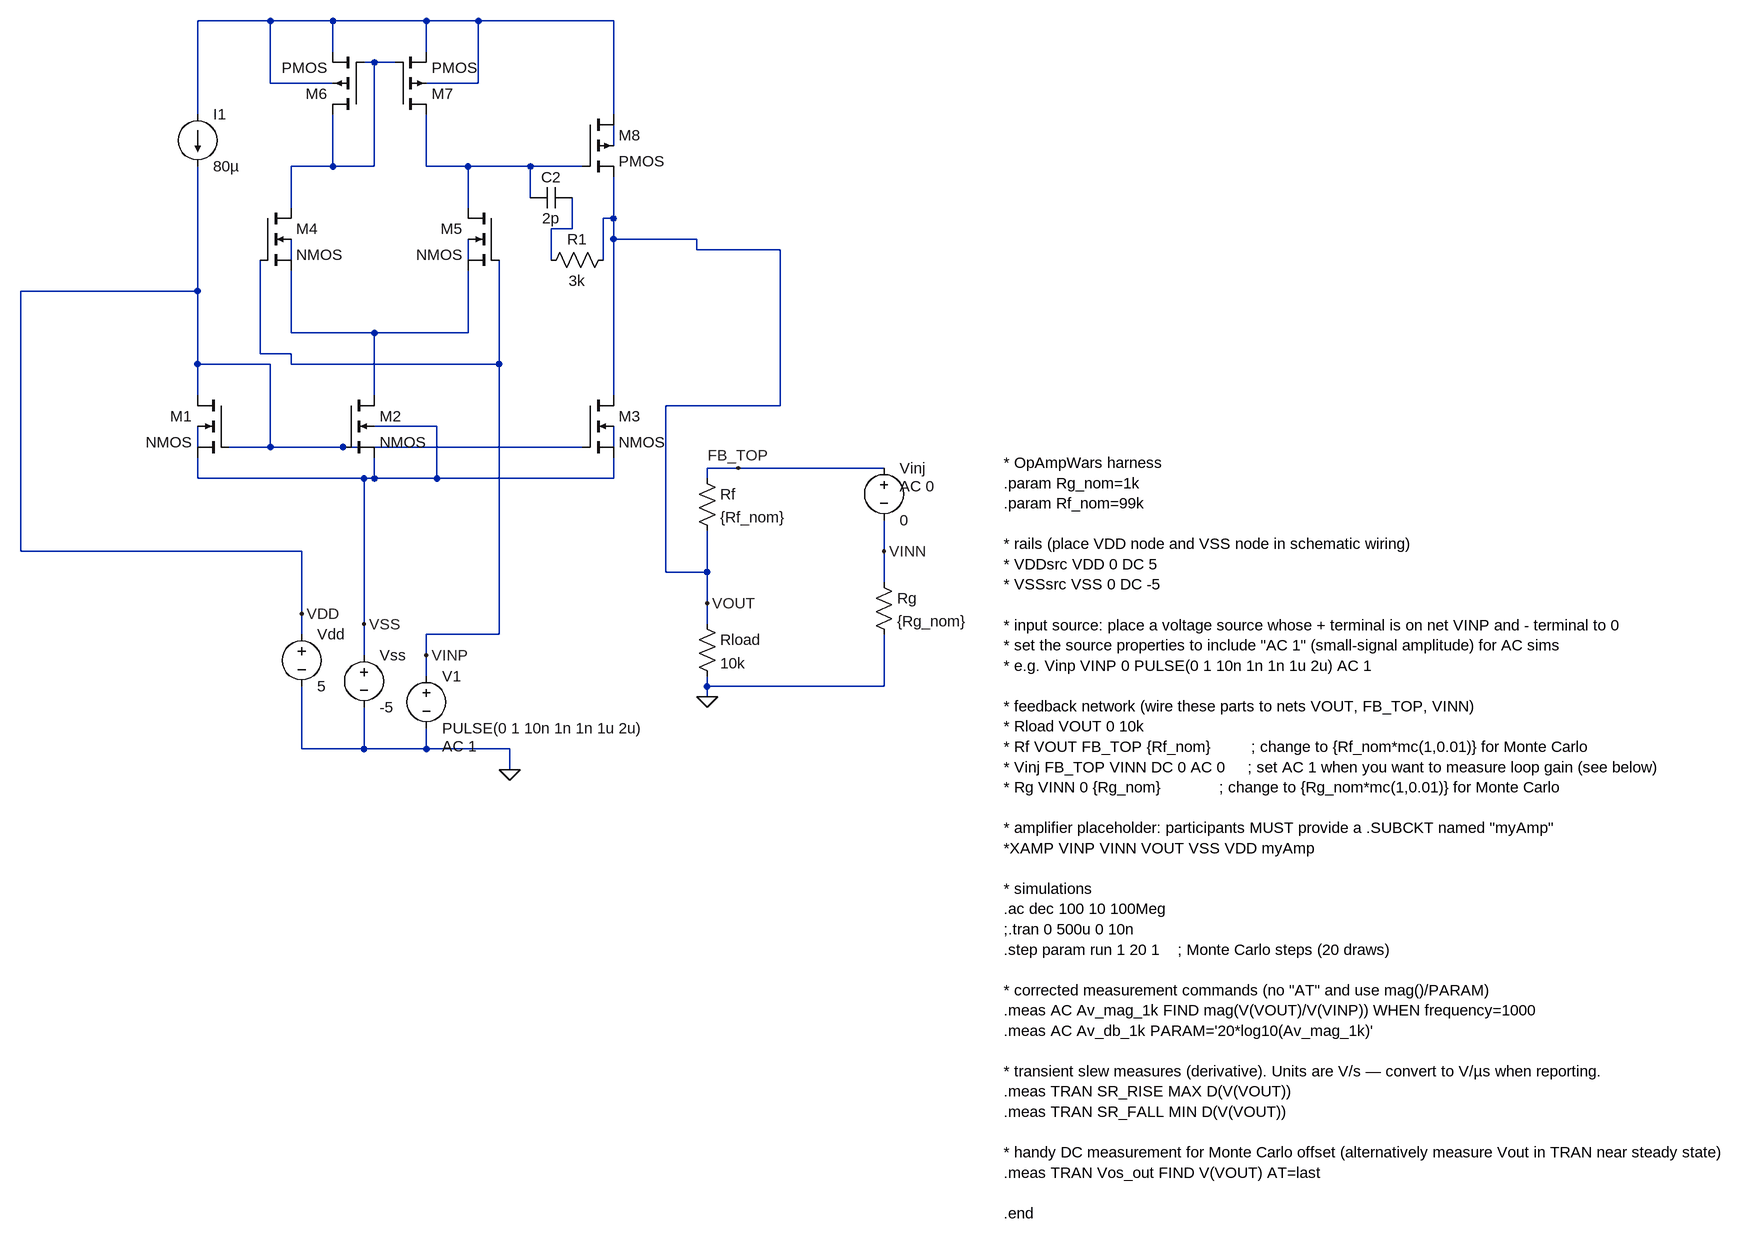
[diagram p0: schematic test.asc]
test.asc, the LTspice schematic file:
Version 4
SHEET 1 3004 2024
WIRE -144 -928 -256 -928
WIRE -48 -928 -144 -928
WIRE 96 -928 -48 -928
WIRE 176 -928 96 -928
WIRE 384 -928 176 -928
WIRE -48 -880 -48 -928
WIRE 96 -880 96 -928
WIRE 16 -864 0 -864
WIRE 48 -864 16 -864
WIRE -144 -832 -144 -928
WIRE -48 -832 -144 -832
WIRE 176 -832 176 -928
WIRE 176 -832 96 -832
WIRE -256 -784 -256 -928
WIRE 384 -784 384 -928
WIRE 384 -736 384 -768
WIRE -48 -704 -48 -784
WIRE -48 -704 -112 -704
WIRE 16 -704 16 -864
WIRE 16 -704 -48 -704
WIRE 96 -704 96 -784
WIRE 160 -704 96 -704
WIRE 256 -704 160 -704
WIRE 336 -704 256 -704
WIRE 256 -656 256 -704
WIRE -112 -640 -112 -704
WIRE 160 -640 160 -704
WIRE 384 -624 384 -688
WIRE 384 -624 368 -624
WIRE 320 -608 320 -656
WIRE 320 -608 288 -608
WIRE 384 -592 384 -624
WIRE 512 -592 384 -592
WIRE 512 -576 512 -592
WIRE 640 -576 512 -576
WIRE -112 -560 -112 -592
WIRE 160 -560 160 -592
WIRE 288 -560 288 -608
WIRE 368 -560 368 -624
WIRE -256 -512 -256 -704
WIRE -256 -512 -528 -512
WIRE -112 -448 -112 -544
WIRE 16 -448 -112 -448
WIRE 160 -448 160 -544
WIRE 160 -448 16 -448
WIRE -160 -416 -160 -560
WIRE -112 -416 -160 -416
WIRE -256 -400 -256 -512
WIRE -144 -400 -256 -400
WIRE -112 -400 -112 -416
WIRE 208 -400 208 -560
WIRE 208 -400 -112 -400
WIRE -256 -352 -256 -400
WIRE 16 -352 16 -448
WIRE 384 -352 384 -592
WIRE 640 -336 640 -576
WIRE 640 -336 464 -336
WIRE 112 -304 16 -304
WIRE -256 -272 -256 -304
WIRE -144 -272 -144 -400
WIRE -144 -272 -208 -272
WIRE -32 -272 -144 -272
WIRE 336 -272 -32 -272
WIRE 384 -272 384 -304
WIRE 576 -240 528 -240
WIRE 800 -240 576 -240
WIRE -256 -224 -256 -256
WIRE 0 -224 -256 -224
WIRE 16 -224 16 -256
WIRE 16 -224 0 -224
WIRE 112 -224 112 -304
WIRE 112 -224 16 -224
WIRE 384 -224 384 -256
WIRE 384 -224 112 -224
WIRE 528 -224 528 -240
WIRE -528 -112 -528 -512
WIRE -96 -112 -528 -112
WIRE 800 -112 800 -160
WIRE 464 -80 464 -336
WIRE 528 -80 528 -144
WIRE 528 -80 464 -80
WIRE 800 -64 800 -112
WIRE 528 -32 528 -80
WIRE -96 -16 -96 -112
WIRE 0 0 0 -224
WIRE 528 0 528 -32
WIRE -96 16 -96 -16
WIRE 208 16 208 -400
WIRE 208 16 96 16
WIRE 0 48 0 0
WIRE 96 48 96 16
WIRE 96 80 96 48
WIRE 528 96 528 80
WIRE 800 96 800 16
WIRE 800 96 528 96
WIRE 528 112 528 96
WIRE -96 192 -96 96
WIRE 0 192 0 128
WIRE 0 192 -96 192
WIRE 96 192 96 160
WIRE 96 192 0 192
WIRE 224 192 96 192
WIRE 224 224 224 192
FLAG 224 224 0
FLAG -96 -16 VDD
FLAG 0 0 VSS
FLAG 96 48 VINP
FLAG 528 112 0
FLAG 528 -32 VOUT
FLAG 576 -240 FB_TOP
FLAG 800 -112 VINN
SYMBOL voltage 96 64 R0
WINDOW 123 24 124 Left 2
WINDOW 39 0 0 Left 0
SYMATTR Value2 AC 1
SYMATTR InstName V1
SYMATTR Value PULSE(0 1 10n 1n 1n 1u 2u)
SYMBOL voltage 0 32 R0
WINDOW 123 0 0 Left 0
WINDOW 39 0 0 Left 0
SYMATTR InstName Vss
SYMATTR Value -5
SYMBOL voltage -96 0 R0
WINDOW 123 0 0 Left 0
WINDOW 39 0 0 Left 0
SYMATTR InstName Vdd
SYMATTR Value 5
SYMBOL res 512 -240 R0
SYMATTR InstName Rf
SYMATTR Value {Rf_nom}
SYMBOL res 784 -80 R0
SYMATTR InstName Rg
SYMATTR Value {Rg_nom}
SYMBOL res 512 -16 R0
SYMATTR InstName Rload
SYMATTR Value 10k
SYMBOL voltage 800 -256 R0
WINDOW 123 24 44 Left 2
WINDOW 39 0 0 Left 0
SYMATTR Value2 AC 0
SYMATTR InstName Vinj
SYMATTR Value 0
SYMBOL nmos4 -208 -352 M0
SYMATTR InstName M1
SYMBOL nmos4 -32 -352 R0
SYMATTR InstName M2
SYMBOL nmos4 336 -352 R0
SYMATTR InstName M3
SYMBOL nmos4 -160 -640 R0
SYMATTR InstName M4
SYMBOL nmos4 208 -640 M0
SYMATTR InstName M5
SYMBOL pmos4 0 -784 R180
SYMATTR InstName M6
SYMBOL pmos4 48 -784 M180
SYMATTR InstName M7
SYMBOL pmos4 336 -784 R0
SYMATTR InstName M8
SYMBOL cap 320 -672 R90
WINDOW 0 0 32 VBottom 2
WINDOW 3 32 32 VTop 2
SYMATTR InstName C2
SYMATTR Value 2p
SYMBOL current -256 -784 R0
WINDOW 123 0 0 Left 0
WINDOW 39 0 0 Left 0
SYMATTR InstName I1
SYMATTR Value 80µ
SYMBOL res 384 -576 R90
WINDOW 0 0 56 VBottom 2
WINDOW 3 32 56 VTop 2
SYMATTR InstName R1
SYMATTR Value 3k
TEXT 984 -248 Left 2 !* OpAmpWars harness\n.param Rg_nom=1k\n.param Rf_nom=99k\n \n* rails (place VDD node and VSS node in schematic wiring)\n* VDDsrc VDD 0 DC 5\n* VSSsrc VSS 0 DC -5\n \n* input source: place a voltage source whose + terminal is on net VINP and - terminal to 0\n* set the source properties to include "AC 1" (small-signal amplitude) for AC sims\n* e.g. Vinp VINP 0 PULSE(0 1 10n 1n 1n 1u 2u) AC 1\n \n* feedback network (wire these parts to nets VOUT, FB_TOP, VINN)\n* Rload VOUT 0 10k\n* Rf VOUT FB_TOP {Rf_nom}         ; change to {Rf_nom*mc(1,0.01)} for Monte Carlo\n* Vinj FB_TOP VINN DC 0 AC 0     ; set AC 1 when you want to measure loop gain (see below)\n* Rg VINN 0 {Rg_nom}             ; change to {Rg_nom*mc(1,0.01)} for Monte Carlo\n \n* amplifier placeholder: participants MUST provide a .SUBCKT named "myAmp"\n*XAMP VINP VINN VOUT VSS VDD myAmp\n \n* simulations\n.ac dec 100 10 100Meg\n;.tran 0 500u 0 10n\n.step param run 1 20 1    ; Monte Carlo steps (20 draws)\n \n* corrected measurement commands (no "AT" and use mag()/PARAM)\n.meas AC Av_mag_1k FIND mag(V(VOUT)/V(VINP)) WHEN frequency=1000\n.meas AC Av_db_1k PARAM='20*log10(Av_mag_1k)'\n \n* transient slew measures (derivative). Units are V/s — convert to V/µs when reporting.\n.meas TRAN SR_RISE MAX D(V(VOUT))\n.meas TRAN SR_FALL MIN D(V(VOUT))\n \n* handy DC measurement for Monte Carlo offset (alternatively measure Vout in TRAN near steady state)\n.meas TRAN Vos_out FIND V(VOUT) AT=last\n \n.end

The netlist it stands for:
* test.asc
V1 VINP 0 PULSE(0 1 10n 1n 1n 1u 2u) AC 1
Vss VSS 0 -5
Vdd VDD 0 5
Rf FB_TOP VOUT {Rf_nom}
Rg VINN 0 {Rg_nom}
Rload VOUT 0 10k
Vinj FB_TOP VINN 0 AC 0
M1 VDD VDD VSS N009 NMOS
M2 N008 VDD VSS VSS NMOS
M3 VOUT VDD VSS N010 NMOS
M4 N002 VINP N008 N006 NMOS
M5 N004 VINP N008 N007 NMOS
M6 N002 N002 N001 N001 PMOS
M7 N004 N002 N001 N001 PMOS
M8 N001 N004 VOUT N003 PMOS
C2 N005 N004 2p
I1 N001 VDD 80µ
R1 VOUT N005 3k
.model NMOS NMOS
.model PMOS PMOS
.lib standard.mos
* OpAmpWars harness
.param Rg_nom=1k
.param Rf_nom=99k
* rails (place VDD node and VSS node in schematic wiring)
* VDDsrc VDD 0 DC 5
* VSSsrc VSS 0 DC -5
* input source: place a voltage source whose + terminal is on net VINP and - terminal to 0
* set the source properties to include "AC 1" (small-signal amplitude) for AC sims
* e.g. Vinp VINP 0 PULSE(0 1 10n 1n 1n 1u 2u) AC 1
* feedback network (wire these parts to nets VOUT, FB_TOP, VINN)
* Rload VOUT 0 10k
* Rf VOUT FB_TOP {Rf_nom}         ; change to {Rf_nom*mc(1,0.01)} for Monte Carlo
* Vinj FB_TOP VINN DC 0 AC 0     ; set AC 1 when you want to measure loop gain (see below)
* Rg VINN 0 {Rg_nom}             ; change to {Rg_nom*mc(1,0.01)} for Monte Carlo
* amplifier placeholder: participants MUST provide a .SUBCKT named "myAmp"
*XAMP VINP VINN VOUT VSS VDD myAmp
* simulations
.ac dec 100 10 100Meg
;.tran 0 500u 0 10n
.step param run 1 20 1    ; Monte Carlo steps (20 draws)
* corrected measurement commands (no "AT" and use mag()/PARAM)
.meas AC Av_mag_1k FIND mag(V(VOUT)/V(VINP)) WHEN frequency=1000
.meas AC Av_db_1k PARAM='20*log10(Av_mag_1k)'
* transient slew measures (derivative). Units are V/s — convert to V/µs when reporting.
.meas TRAN SR_RISE MAX D(V(VOUT))
.meas TRAN SR_FALL MIN D(V(VOUT))
* handy DC measurement for Monte Carlo offset (alternatively measure Vout in TRAN near steady state)
.meas TRAN Vos_out FIND V(VOUT) AT=last
.end
.backanno
.end